# EasyEDA schematic EasyEDA - oq0017 revE.json
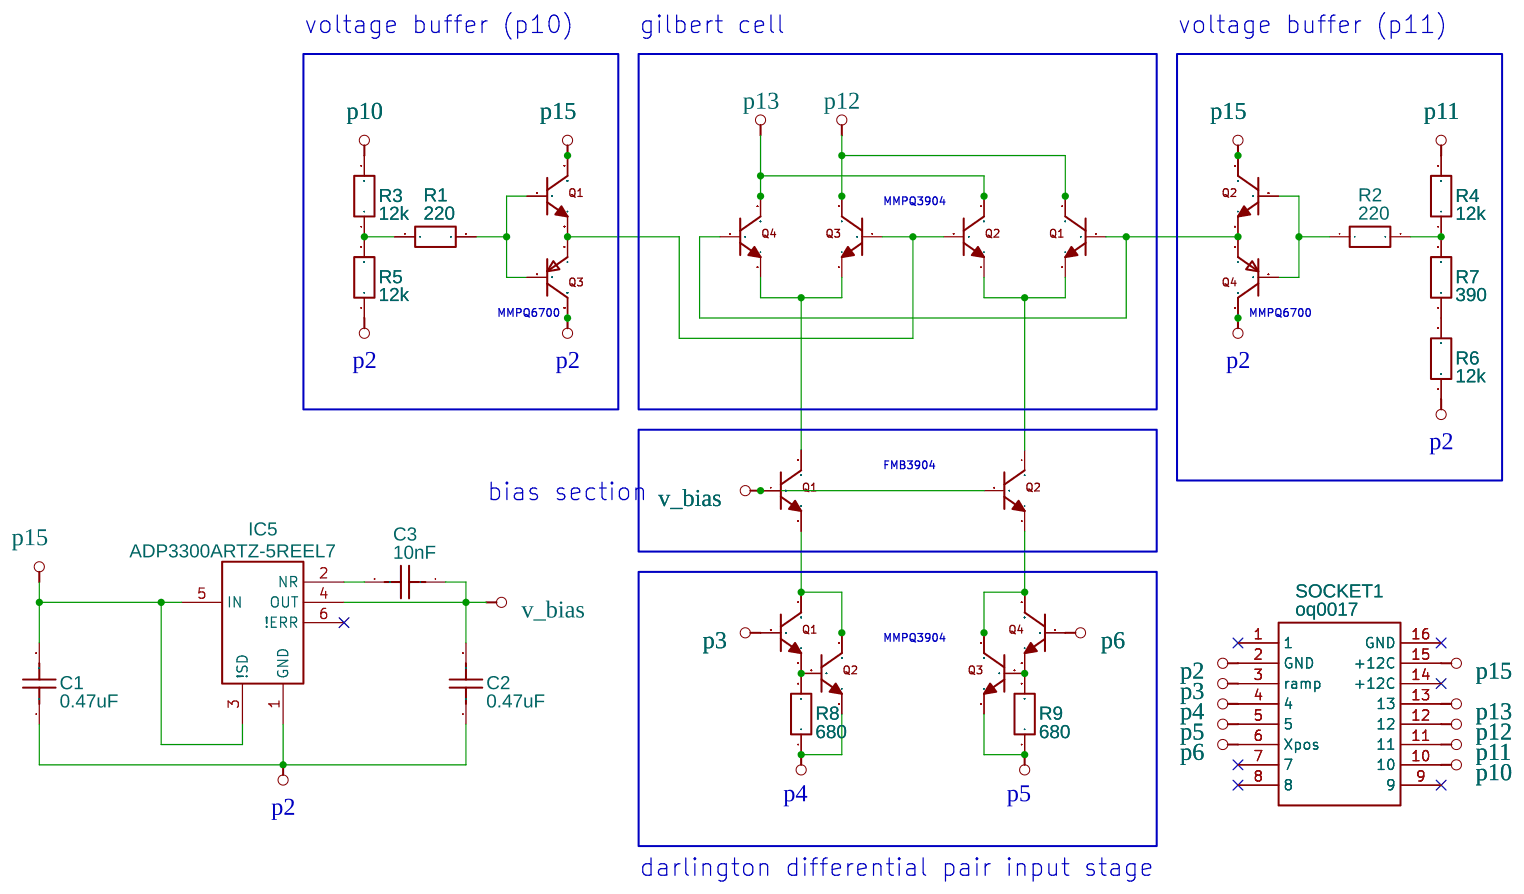
[diagram p0: schematic sheet]

## Parts
C1  0.47uF  [C1206]
C2  0.47uF  [C1206]
C3  10nF  [C1206]
IC1  MMPQ3904  [BLANK SO-16]  (sections 1,2,3,4)
IC2  MMPQ6700  [BLANK SO-16]  (sections 1,2,3,4)
IC3  FMB3904  [BLANK SSOT-6]  (sections 1,2)
IC4  MMPQ3904  [BLANK SO-16]  (sections 1,2,3,4)
IC5  ADP3300ARTZ-5REEL7  [BLANK SSOT-6]
R1  220  [R1206]
R2  220  [R1206]
R3  12k  [R1206]
R4  12k  [R1206]
R5  12k  [R1206]
R6  12k  [R1206]
R7  390  [R1206]
R8  680  [R1206]
R9  680  [R1206]
SOCKET1  oq0017  [BLANK DIP-16]

## Library data of the parts
C1 C2 = C_1206_US: Supplier Part: T491A474K025AT7280; Contributor: LCEDA_Lib
C3 = C_1206_US: Supplier Part: C1206X103JBGACAUTO; Contributor: LCEDA_Lib
IC1 IC4 = MMPQ3904: Contributor: macafeeje; subpart_no: 1
IC2 = MMPQ6700: Contributor: MacAfeeje; subpart_no: 1
IC3 = FMB3904: Contributor: MacAfeeje; subpart_no: 1
IC5 = ADP3300ARTZ-5REEL7: Contributor: macafeeje
R1 R2 = R_1206_EU: Supplier Part: RG3216P-2200-D-T5; Contributor: LCEDA_Lib
R3-R6 = R_1206_EU: Supplier Part: RG3216N-1202-B-T1; Contributor: LCEDA_Lib
R7 = R_1206_EU: Supplier Part: RG3216N-3900-B-T1; Contributor: LCEDA_Lib
R8 R9 = R_1206_EU: Supplier Part: RG3216P-6800-D-T5; Contributor: LCEDA_Lib
SOCKET1 = oq0017: Supplier Part: DW-16-10-T-S-450; Contributor: MacAfeeje

## Nets
p2: C1.1 C2.1 IC2.5(C) IC2.6(C) IC2.7(C) IC2.8(C) IC5.1(GND) R5.1 R6.1 SOCKET1.2(GND)
p3: IC4.15(B) SOCKET1.3(ramp)
p4: IC4.14(E) R8.1 SOCKET1.4
p5: IC4.12(E) R9.1 SOCKET1.5
p6: IC4.9(B) SOCKET1.6(Xpos)
p10: R3.2 SOCKET1.10
p11: R4.2 SOCKET1.11
p12: IC1.1(C) IC1.2(C) IC1.5(C) IC1.6(C) SOCKET1.12
p13: IC1.3(C) IC1.4(C) IC1.7(C) IC1.8(C) SOCKET1.13
p15: C1.2 IC2.1(C) IC2.2(C) IC2.3(C) IC2.4(C) IC5.3(!SD) IC5.5(IN) SOCKET1.15(+12C)
v_bias: C2.2 C3.1 IC3.4(B) IC3.6(B) IC5.4(OUT)
Net-(C3-2): C3.2 IC5.2(NR)
Net-(IC1.1-15): IC1.9(B) IC1.15(B) IC2.10(E) IC2.14(E)
Net-(IC1.1-16): IC1.14(E) IC1.16(E) IC3.1(C)
Net-(IC1.2-13): IC1.11(B) IC1.13(B) IC2.12(E) IC2.16(E)
Net-(IC1.3-12): IC1.10(E) IC1.12(E) IC3.3(C)
Net-(IC2.1-15): IC2.11(B) IC2.15(B) R1.2
Net-(IC2.2-13): IC2.9(B) IC2.13(B) R2.1
Net-(IC3.1-2): IC3.2(E) IC4.1(C) IC4.2(C) IC4.3(C) IC4.4(C)
Net-(IC3.2-5): IC3.5(E) IC4.5(C) IC4.6(C) IC4.7(C) IC4.8(C)
Net-(IC4.1-16): IC4.13(B) IC4.16(E) R8.2
Net-(IC4.3-11): IC4.10(E) IC4.11(B) R9.2
Net-(R1-1): R1.1 R3.1 R5.2
Net-(R2-2): R2.2 R4.1 R7.2
Net-(R6-2): R6.2 R7.1

Not connected (* = marked no-connect by the designer): IC5 6(!ERR)*; SOCKET1 1* 7* 8* 9* 14(+12C)* 16(GND)*

## Notes on the sheet
- voltage buffer (p10)
- gilbert cell
- voltage buffer (p11)
- MMPQ3904
- MMPQ6700
- MMPQ6700
- FMB3904
- bias section
- MMPQ3904
- darlington differential pair input stage
